# Altium schematic sheet ADC.SchDoc
size A4
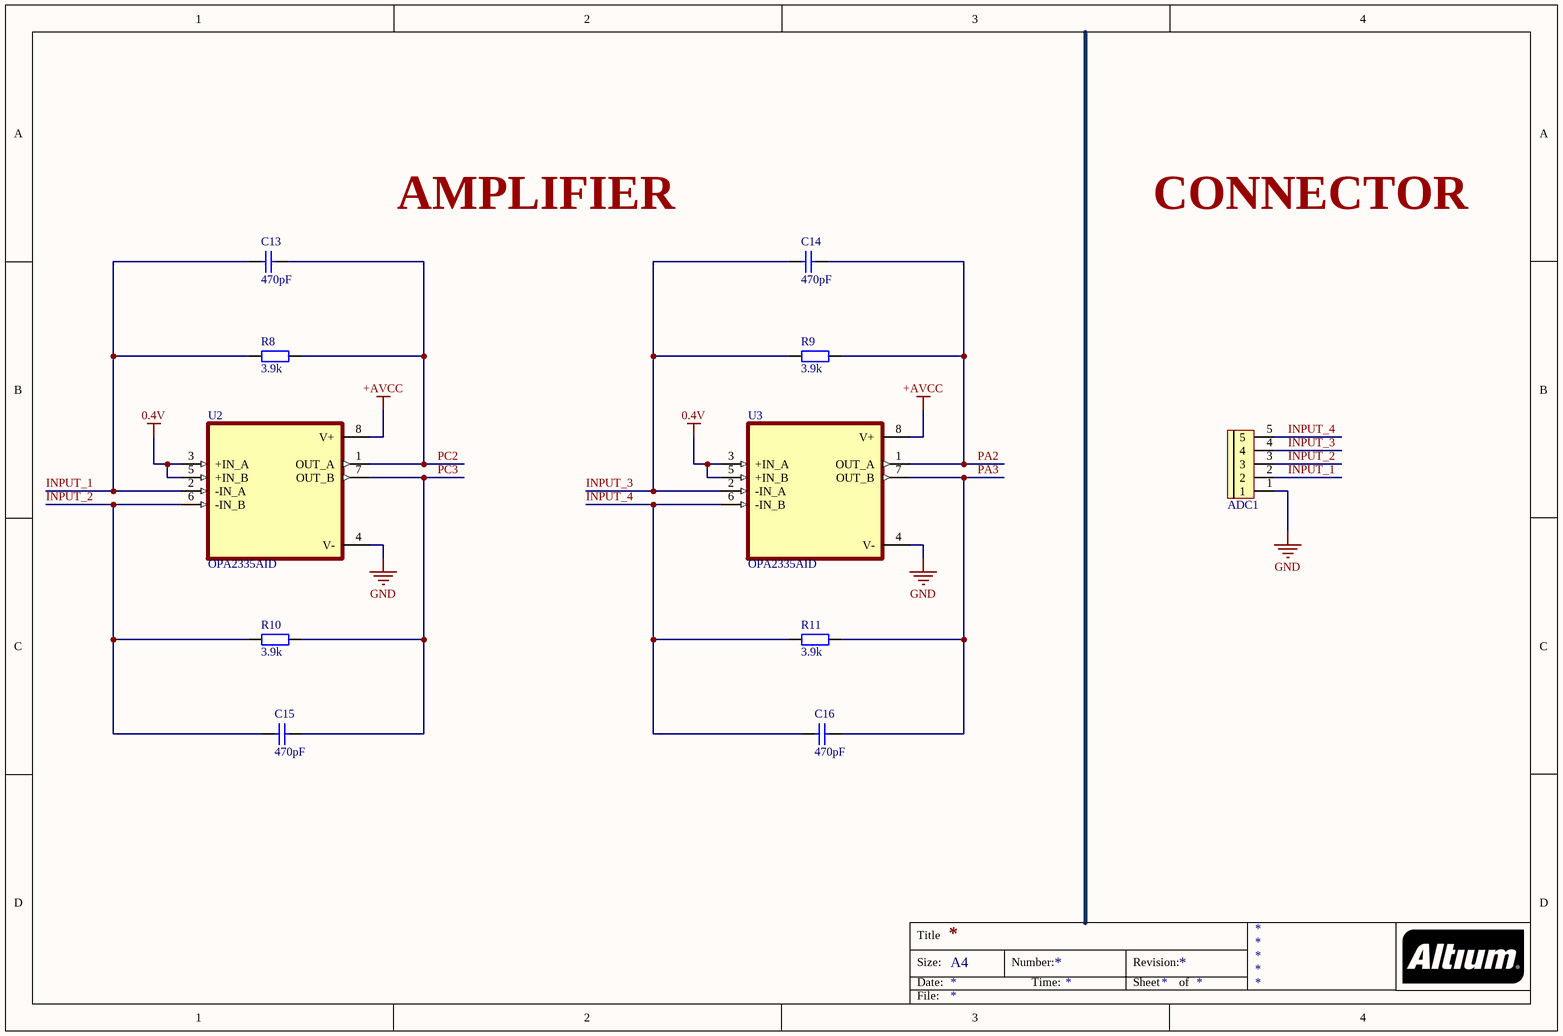
[diagram p0: ADC.SchDoc]

## Parts
ADC1  CON 5 EDG5.08  [CON 5 5EDG5.08]  (value not drawn)
C13  470pF  [tu 0603]
C14  470pF  [tu 0603]
C15  470pF  [tu 0603]
C16  470pF  [tu 0603]
R8  3.9k  [tro smd 0603]
R9  3.9k  [tro smd 0603]
R10  3.9k  [tro smd 0603]
R11  3.9k  [tro smd 0603]
U2  OPA2335AID  [SOIC127P599X175-8N]
U3  OPA2335AID  [SOIC127P599X175-8N]

## Nets
0.4V: U2.3(+IN_A) U2.5(+IN_B) U3.3(+IN_A) U3.5(+IN_B)
+AVCC: U2.8(V+) U3.8(V+)
GND: ADC1.1 U2.4(V-) U3.4(V-)
INPUT_1: ADC1.2 C13.2 R8.1 U2.2(-IN_A)
INPUT_2: ADC1.3 C15.2 R10.1 U2.6(-IN_B)
INPUT_3: ADC1.4 C14.2 R9.1 U3.2(-IN_A)
INPUT_4: ADC1.5 C16.2 R11.1 U3.6(-IN_B)
PA2: C14.1 R9.2 U3.1(OUT_A)
PA3: C16.1 R11.2 U3.7(OUT_B)
PC2: C13.1 R8.2 U2.1(OUT_A)
PC3: C15.1 R10.2 U2.7(OUT_B)

## Notes on the sheet
- AMPLIFIER
- CONNECTOR
- Title
- Size:
- Date:
- A4
- Number:
- Time:
- Revision:
- Sheet
- of
- File:

## Library data of the parts
ADC1 = CON 5 EDG5.08: Cắm; Ten_Linh_Kien: CON 5 2EDG5.08-5P 5.08MM ( Xanh Cong); Ma_Hang: MH003589; Kieu_Chan: *; Don_Vi: Con; Ghi_Chu: *; Chung_Loai: Cắm
C13-C16 = Tu 0603 470pF 50V 10%: Dán; Don_Vi: Con; So_Chan: 2; Ten_Linh_Kien: Tụ 0603 470P 50V 10%; Ma_Hang: MH004571; Chung_Loai: Dán; Kieu_Chan: *
R8-R11 = Tro 0603 1% 3.9k: Dán; So_Chan: 2; Ten_Linh_Kien: Trở 0603 1% 3.9k; Ma_Hang: MH005793; Don_Vi: Con; Chung_Loai: Dán; Kieu_Chan: *
U2 U3 = OPA2335AID: MF: {'manufacturer': u'Texas Instruments'}; Package: None; Price: None; Value: *; MP: OPA2335AID; Availability: Unavailable